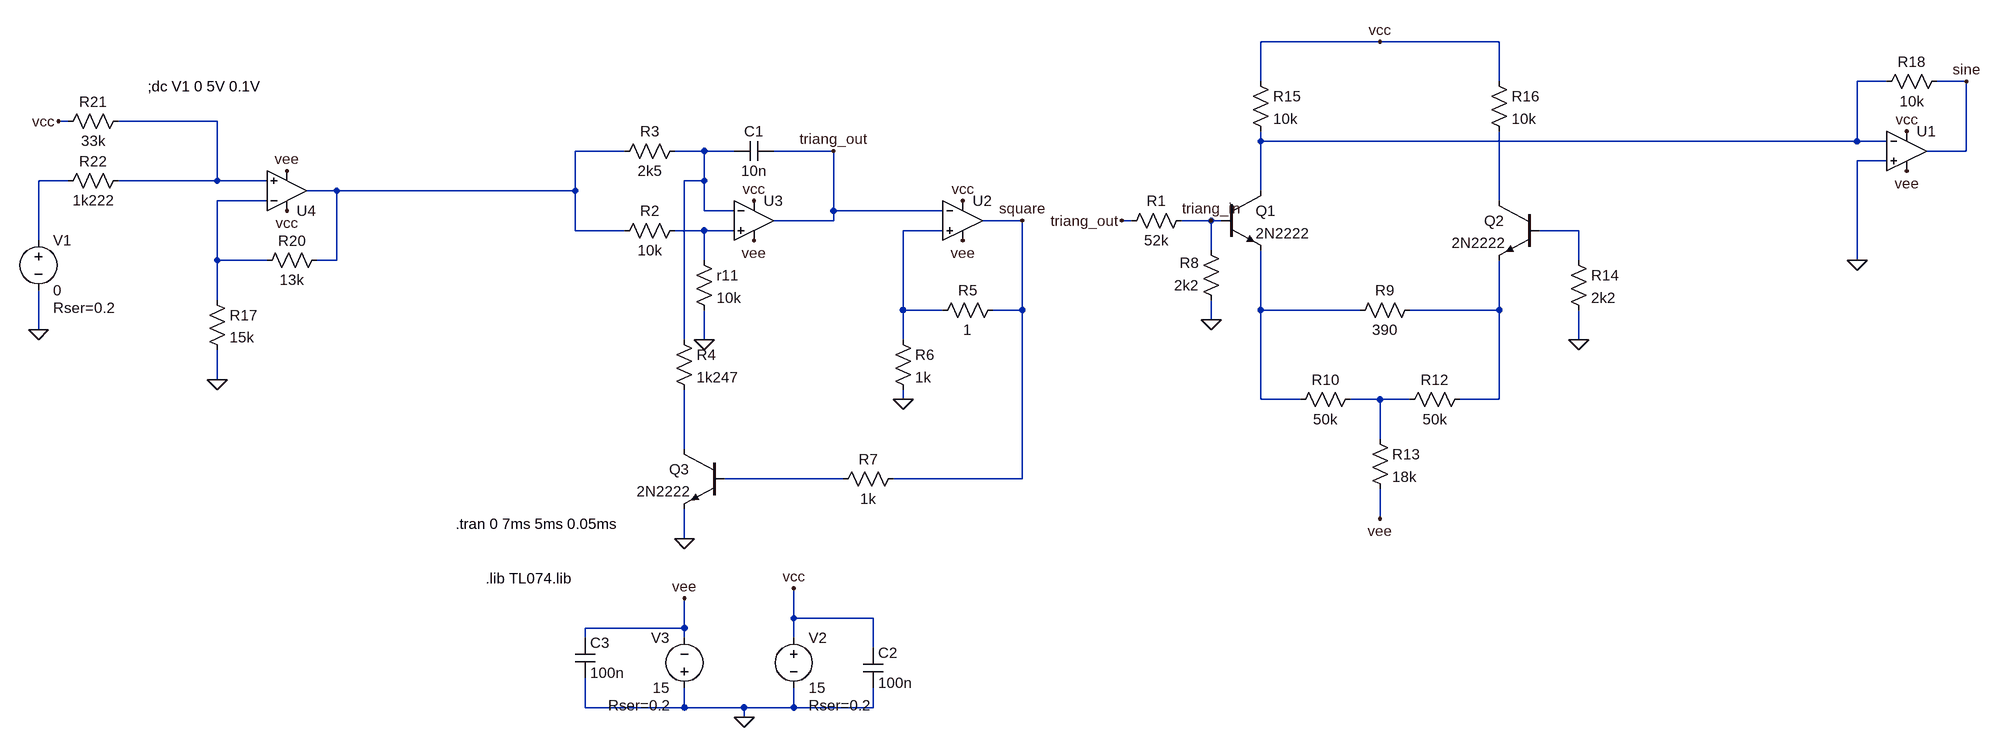
[diagram p0: schematic tc_tp6_ej3.asc]
tc_tp6_ej3.asc, the LTspice schematic file:
Version 4
SHEET 1 2716 740
WIRE 1264 -368 1072 -368
WIRE 1456 -368 1264 -368
WIRE 1072 -304 1072 -368
WIRE 1456 -304 1456 -368
WIRE 2080 -304 2032 -304
WIRE 2208 -304 2160 -304
WIRE -848 -240 -864 -240
WIRE -608 -240 -768 -240
WIRE 1072 -208 1072 -224
WIRE 2032 -208 2032 -304
WIRE 2032 -208 1072 -208
WIRE 2080 -208 2032 -208
WIRE 48 -192 -32 -192
WIRE 176 -192 128 -192
WIRE 224 -192 176 -192
WIRE 384 -192 288 -192
WIRE 2208 -192 2208 -304
WIRE 2208 -192 2144 -192
WIRE 2080 -176 2032 -176
WIRE -848 -144 -896 -144
WIRE -608 -144 -608 -240
WIRE -608 -144 -768 -144
WIRE -528 -144 -608 -144
WIRE 176 -144 176 -192
WIRE 176 -144 144 -144
WIRE -416 -128 -464 -128
WIRE -32 -128 -32 -192
WIRE -32 -128 -416 -128
WIRE 1072 -128 1072 -208
WIRE -528 -112 -608 -112
WIRE 1456 -112 1456 -224
WIRE 176 -96 176 -144
WIRE 224 -96 176 -96
WIRE 384 -96 384 -192
WIRE 560 -96 384 -96
WIRE 384 -80 384 -96
WIRE 384 -80 288 -80
WIRE 688 -80 624 -80
WIRE 864 -80 848 -80
WIRE 992 -80 944 -80
WIRE 1008 -80 992 -80
WIRE -32 -64 -32 -128
WIRE 48 -64 -32 -64
WIRE 176 -64 128 -64
WIRE 224 -64 176 -64
WIRE 560 -64 496 -64
WIRE 1584 -64 1520 -64
WIRE -896 -48 -896 -144
WIRE 992 -32 992 -80
WIRE -608 -16 -608 -112
WIRE -528 -16 -608 -16
WIRE -416 -16 -416 -128
WIRE -416 -16 -448 -16
WIRE 176 -16 176 -64
WIRE 1584 -16 1584 -64
WIRE 2032 -16 2032 -176
WIRE -608 48 -608 -16
WIRE 496 64 496 -64
WIRE 560 64 496 64
WIRE 688 64 688 -80
WIRE 688 64 640 64
WIRE 1072 64 1072 -32
WIRE 1232 64 1072 64
WIRE 1456 64 1456 -16
WIRE 1456 64 1312 64
WIRE 992 80 992 48
WIRE -896 96 -896 32
WIRE 144 112 144 -144
WIRE 176 112 176 64
WIRE 496 112 496 64
WIRE 1584 112 1584 64
WIRE -608 176 -608 128
WIRE 496 208 496 192
WIRE 1072 208 1072 64
WIRE 1136 208 1072 208
WIRE 1264 208 1216 208
WIRE 1312 208 1264 208
WIRE 1456 208 1456 64
WIRE 1456 208 1392 208
WIRE 1264 272 1264 208
WIRE 144 288 144 192
WIRE 400 336 208 336
WIRE 688 336 688 64
WIRE 688 336 480 336
WIRE 1264 400 1264 352
WIRE 144 432 144 384
WIRE 320 560 320 512
WIRE 448 560 320 560
WIRE 144 576 144 528
WIRE 144 576 -16 576
WIRE -16 592 -16 576
WIRE 144 592 144 576
WIRE 320 592 320 560
WIRE 448 608 448 560
WIRE -16 704 -16 656
WIRE 144 704 144 672
WIRE 144 704 -16 704
WIRE 240 704 144 704
WIRE 320 704 320 672
WIRE 320 704 240 704
WIRE 448 704 448 672
WIRE 448 704 320 704
WIRE 240 720 240 704
FLAG 176 112 0
FLAG 496 208 0
FLAG -896 96 0
FLAG 240 720 0
FLAG 320 512 vcc
FLAG 592 -112 vcc
FLAG 256 -112 vcc
FLAG 144 528 vee
FLAG 592 -48 vee
FLAG 256 -48 vee
FLAG 992 80 0
FLAG 1584 112 0
FLAG 384 -192 triang_out
FLAG 848 -80 triang_out
FLAG 992 -80 triang_in
FLAG 1264 -368 vcc
FLAG 1264 400 vee
FLAG 2032 -16 0
FLAG 2112 -224 vcc
FLAG 2112 -160 vee
FLAG 144 432 0
FLAG 2208 -304 sine
FLAG 688 -80 square
FLAG -608 176 0
FLAG -496 -96 vcc
FLAG -496 -160 vee
FLAG -864 -240 vcc
SYMBOL res 160 -32 R0
SYMATTR InstName r11
SYMATTR Value 10k
SYMBOL res 144 -80 R90
WINDOW 0 0 56 VBottom 2
WINDOW 3 32 56 VTop 2
SYMATTR InstName R2
SYMATTR Value 10k
SYMBOL voltage -896 -64 R0
WINDOW 123 0 0 Left 0
WINDOW 39 24 124 Left 2
SYMATTR SpiceLine Rser=0.2
SYMATTR InstName V1
SYMATTR Value 0
SYMBOL res 144 -208 R90
WINDOW 0 0 56 VBottom 2
WINDOW 3 32 56 VTop 2
SYMATTR InstName R3
SYMATTR Value 2k5
SYMBOL cap 288 -208 R90
WINDOW 0 0 32 VBottom 2
WINDOW 3 32 32 VTop 2
SYMATTR InstName C1
SYMATTR Value 10n
SYMBOL res 128 96 R0
SYMATTR InstName R4
SYMATTR Value 1k247
SYMBOL voltage 320 576 R0
WINDOW 123 0 0 Left 0
WINDOW 39 24 124 Left 2
SYMATTR SpiceLine Rser=0.2
SYMATTR InstName V2
SYMATTR Value 15
SYMBOL voltage 144 688 R180
WINDOW 0 24 96 Left 2
WINDOW 3 24 16 Left 2
WINDOW 123 0 0 Left 0
WINDOW 39 24 -12 Left 2
SYMATTR InstName V3
SYMATTR Value 15
SYMATTR SpiceLine Rser=0.2
SYMBOL res 656 48 R90
WINDOW 0 0 56 VBottom 2
WINDOW 3 32 56 VTop 2
SYMATTR InstName R5
SYMATTR Value 1
SYMBOL res 480 96 R0
SYMATTR InstName R6
SYMATTR Value 1k
SYMBOL res 960 -96 R90
WINDOW 0 0 56 VBottom 2
WINDOW 3 32 56 VTop 2
SYMATTR InstName R1
SYMATTR Value 52k
SYMBOL res 1008 64 R180
WINDOW 0 36 76 Left 2
WINDOW 3 36 40 Left 2
SYMATTR InstName R8
SYMATTR Value 2k2
SYMBOL res 1216 80 R270
WINDOW 0 32 56 VTop 2
WINDOW 3 0 56 VBottom 2
SYMATTR InstName R9
SYMATTR Value 390
SYMBOL res 1120 224 R270
WINDOW 0 32 56 VTop 2
WINDOW 3 0 56 VBottom 2
SYMATTR InstName R10
SYMATTR Value 50k
SYMBOL res 1296 224 R270
WINDOW 0 32 56 VTop 2
WINDOW 3 0 56 VBottom 2
SYMATTR InstName R12
SYMATTR Value 50k
SYMBOL res 1248 256 R0
SYMATTR InstName R13
SYMATTR Value 18k
SYMBOL res 1056 -320 R0
SYMATTR InstName R15
SYMATTR Value 10k
SYMBOL res 1440 -320 R0
SYMATTR InstName R16
SYMATTR Value 10k
SYMBOL npn 1008 -128 R0
SYMATTR InstName Q1
SYMATTR Value 2N2222
SYMBOL npn 1520 -112 M0
SYMATTR InstName Q2
SYMATTR Value 2N2222
SYMBOL res 1568 -32 R0
SYMATTR InstName R14
SYMATTR Value 2k2
SYMBOL res 2176 -320 R90
WINDOW 0 0 56 VBottom 2
WINDOW 3 32 56 VTop 2
SYMATTR InstName R18
SYMATTR Value 10k
SYMBOL npn 208 288 M0
SYMATTR InstName Q3
SYMATTR Value 2N2222
SYMBOL res 496 320 R90
WINDOW 0 0 56 VBottom 2
WINDOW 3 32 56 VTop 2
SYMATTR InstName R7
SYMATTR Value 1k
SYMBOL Opamps\\UniversalOpamp2 2112 -192 R0
SYMATTR InstName U1
SYMBOL Opamps\\UniversalOpamp2 592 -80 R0
SYMATTR InstName U2
SYMBOL Opamps\\UniversalOpamp2 256 -80 R0
SYMATTR InstName U3
SYMBOL Opamps\\UniversalOpamp2 -496 -128 M180
SYMATTR InstName U4
SYMBOL res -624 32 R0
SYMATTR InstName R17
SYMATTR Value 15k
SYMBOL res -432 -32 R90
WINDOW 0 0 56 VBottom 2
WINDOW 3 32 56 VTop 2
SYMATTR InstName R20
SYMATTR Value 13k
SYMBOL res -752 -256 R90
WINDOW 0 0 56 VBottom 2
WINDOW 3 32 56 VTop 2
SYMATTR InstName R21
SYMATTR Value 33k
SYMBOL res -752 -160 R90
WINDOW 0 0 56 VBottom 2
WINDOW 3 32 56 VTop 2
SYMATTR InstName R22
SYMATTR Value 1k222
SYMBOL cap 432 608 R0
SYMATTR InstName C2
SYMATTR Value 100n
SYMBOL cap -32 592 R0
SYMATTR InstName C3
SYMATTR Value 100n
TEXT -224 408 Left 2 !.tran 0 7ms 5ms 0.05ms
TEXT -176 496 Left 2 !.lib TL074.lib
TEXT -720 -296 Left 2 !;dc V1 0 5V 0.1V

The netlist it stands for:
* tc_tp6_ej3.asc
r11 N008 0 10k
R2 N008 N003 10k
V1 N005 0 0 Rser=0.2
R3 N004 N003 2k5
C1 triang_out N004 10n
R4 N004 N014 1k247
V2 vcc 0 15 Rser=0.2
V3 0 vee 15 Rser=0.2
R5 square N009 1
R6 N009 0 1k
R1 triang_in triang_out 52k
R8 0 triang_in 2k2
R9 N011 N012 390
R10 N011 N013 50k
R12 N013 N012 50k
R13 N013 vee 18k
R15 vcc N001 10k
R16 vcc N007 10k
Q1 N001 triang_in N011 0 2N2222
Q2 N007 N010 N012 0 2N2222
R14 N010 0 2k2
R18 sine N001 10k
Q3 N014 N015 0 0 2N2222
R7 square N015 1k
XU1 0 N001 vcc vee sine level.2 Avol=1Meg GBW=10Meg Slew=10Meg ilimit=25m rail=0 Vos=0 phimargin=45 en=0 enk=0 in=0 ink=0 Rin=500Meg  ; pins IN+ IN- V+ V- OUT
XU2 N009 triang_out vcc vee square level.2 Avol=1Meg GBW=10Meg Slew=10Meg ilimit=25m rail=0 Vos=0 phimargin=45 en=0 enk=0 in=0 ink=0 Rin=500Meg  ; pins IN+ IN- V+ V- OUT
XU3 N008 N004 vcc vee triang_out level.2 Avol=1Meg GBW=10Meg Slew=10Meg ilimit=25m rail=0 Vos=0 phimargin=45 en=0 enk=0 in=0 ink=0 Rin=500Meg  ; pins IN+ IN- V+ V- OUT
XU4 N002 N006 vcc vee N003 level.2 Avol=1Meg GBW=10Meg Slew=10Meg ilimit=25m rail=0 Vos=0 phimargin=45 en=0 enk=0 in=0 ink=0 Rin=500Meg  ; pins IN+ IN- V+ V- OUT
R17 N006 0 15k
R20 N003 N006 13k
R21 N002 vcc 33k
R22 N002 N005 1k222
C2 vcc 0 100n
C3 vee 0 100n
.model NPN NPN
.model PNP PNP
.lib standard.bjt
.tran 0 7ms 5ms 0.05ms
.lib TL074.lib
;dc V1 0 5V 0.1V
.lib UniversalOpamps2.sub
.backanno
.end